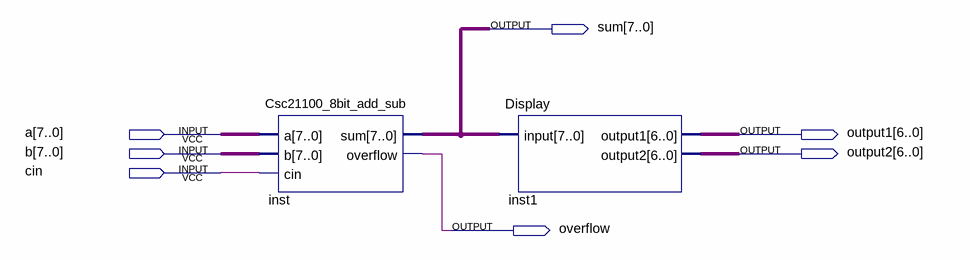
[diagram p0: schematic sheet]
// Quartus schematic Block1.bdf as structural Verilog: 2 symbols, 7 pins
module Block1 (
  input  [7:0] a,
  input  [7:0] b,
  input  cin,
  output [7:0] sum,
  output [6:0] output1,
  output [6:0] output2,
  output overflow
);

  Csc21100_8bit_add_sub inst (.a(a), .b(b), .cin(cin), .sum(sum), .overflow(overflow));
  Display inst1 (.\input (sum), .output1(output1), .output2(output2));
endmodule
